# EAGLE schematic FDTI-UPDI adapter (EAGLE 7.6.0)
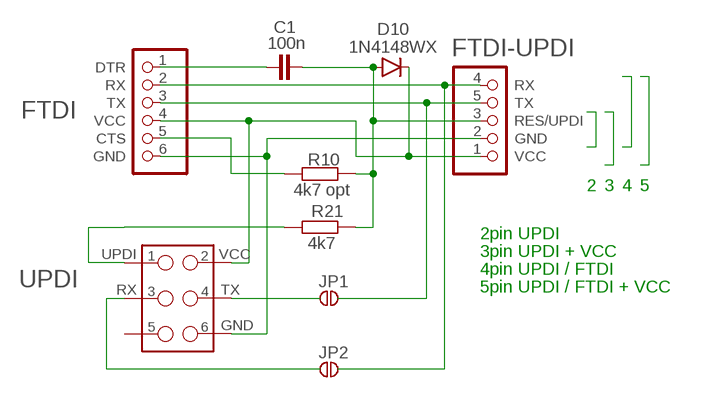
[diagram p0: schematic, sheet 1]

## Parts
C1  100n  SMD-C-0603-SMALL  [0603-SMALL]
D10  1N4148WX  DIODE-SMD  [SOD-323]
J2  FTDI  [ZIGZAG-FTDI]
J100  FTDI-UPDI  [FTDI-UPDI-ZIGZAG]
JP1  JUMPER_SJSMALL  [SJ_2S-NO-NS]
JP2  JUMPER_SJSMALL  [SJ_2S-NO-NS]
R10  4k7 opt  SMD-R-0603-SMALL  [0603-SMALL]
R21  4k7  SMD-R-0603-SMALL  [0603-SMALL]
UPDI  M3X2"  [2X3_TEST_POINTS]

## Nets
4555: C1.2 D10.A J100.3(RES/UPDI) R10.1 R21.1
DTR1: C1.1 J2.1(DTR)
GND: J2.6(GND) J100.2(GND) UPDI.6
N$31: J2.5(CTS) R10.2
RX: JP2.2 UPDI.3
RX1: J2.2(RX) J100.4(RX) JP2.1
TX: JP1.2 UPDI.4
TX1: J2.3(TX) J100.5(TX) JP1.1
UPDI: R21.2 UPDI.1
VCC: D10.C J2.4(VCC) J100.1(VCC) UPDI.2
Unconnected: UPDI.5

## Notes on the sheet
- 2 | 3 | 4 | 5
- 2pin UPDI
- 3pin UPDI + VCC
- 4pin UPDI / FTDI
- 5pin UPDI / FTDI + VCC

## Library data of the parts
C1 = Albert:SMD-C: Capacitors ...4.7uF @ 6.3V -> 0402 ...10uF @ 16V -> 0603 ...22uF @ 25V -> 0805
D10 = Albert:DIODE-SMD
J2 = Albert:FTDI
J100 = Albert:FTDI-UPDI
JP1 JP2 = Albert:JUMPER_SJ: SMD solder JUMPER
R10 R21 = Albert:SMD-R: Resistors all kinds in 0603 and 0402
UPDI = Albert:M3X2